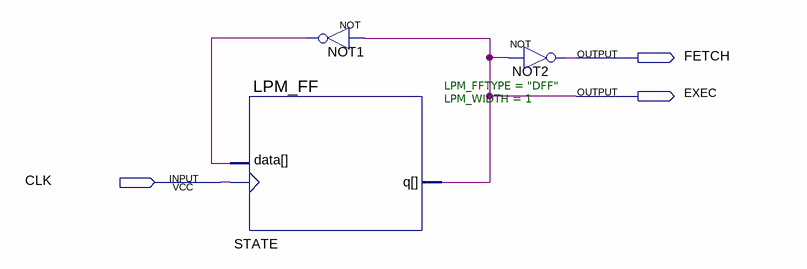
[diagram p0: schematic sheet]
// Quartus schematic SM.bdf as structural Verilog: 3 symbols, 3 pins
module SM (
  input  CLK,
  output FETCH,
  output EXEC
);

  wire NOT1_out;

  LPM_FF #(.LPM_FFTYPE("DFF"), .LPM_WIDTH(1)) STATE (.clock(CLK), .data(NOT1_out), .q(EXEC));
  not NOT1 (NOT1_out, EXEC);
  not NOT2 (FETCH, EXEC);
endmodule
